# Altium schematic sheet Acondicionamiento_Presion.SchDoc: Modulo de Acondicionamiento de Presion
size A4; Date: 09/2013; Author: Roux, Federico G.; CompanyName: UF; Engineer: Roux, Federico G. (rouxfederico@gmail.com); Organization: UF; Address1: rouxfederico@gmail.com; Revision: 1.0; DocumentName: Acondicionamiento_Presion; ProjectName: Pres24 (Módulos); Rule: PcbType=ProtelPcb
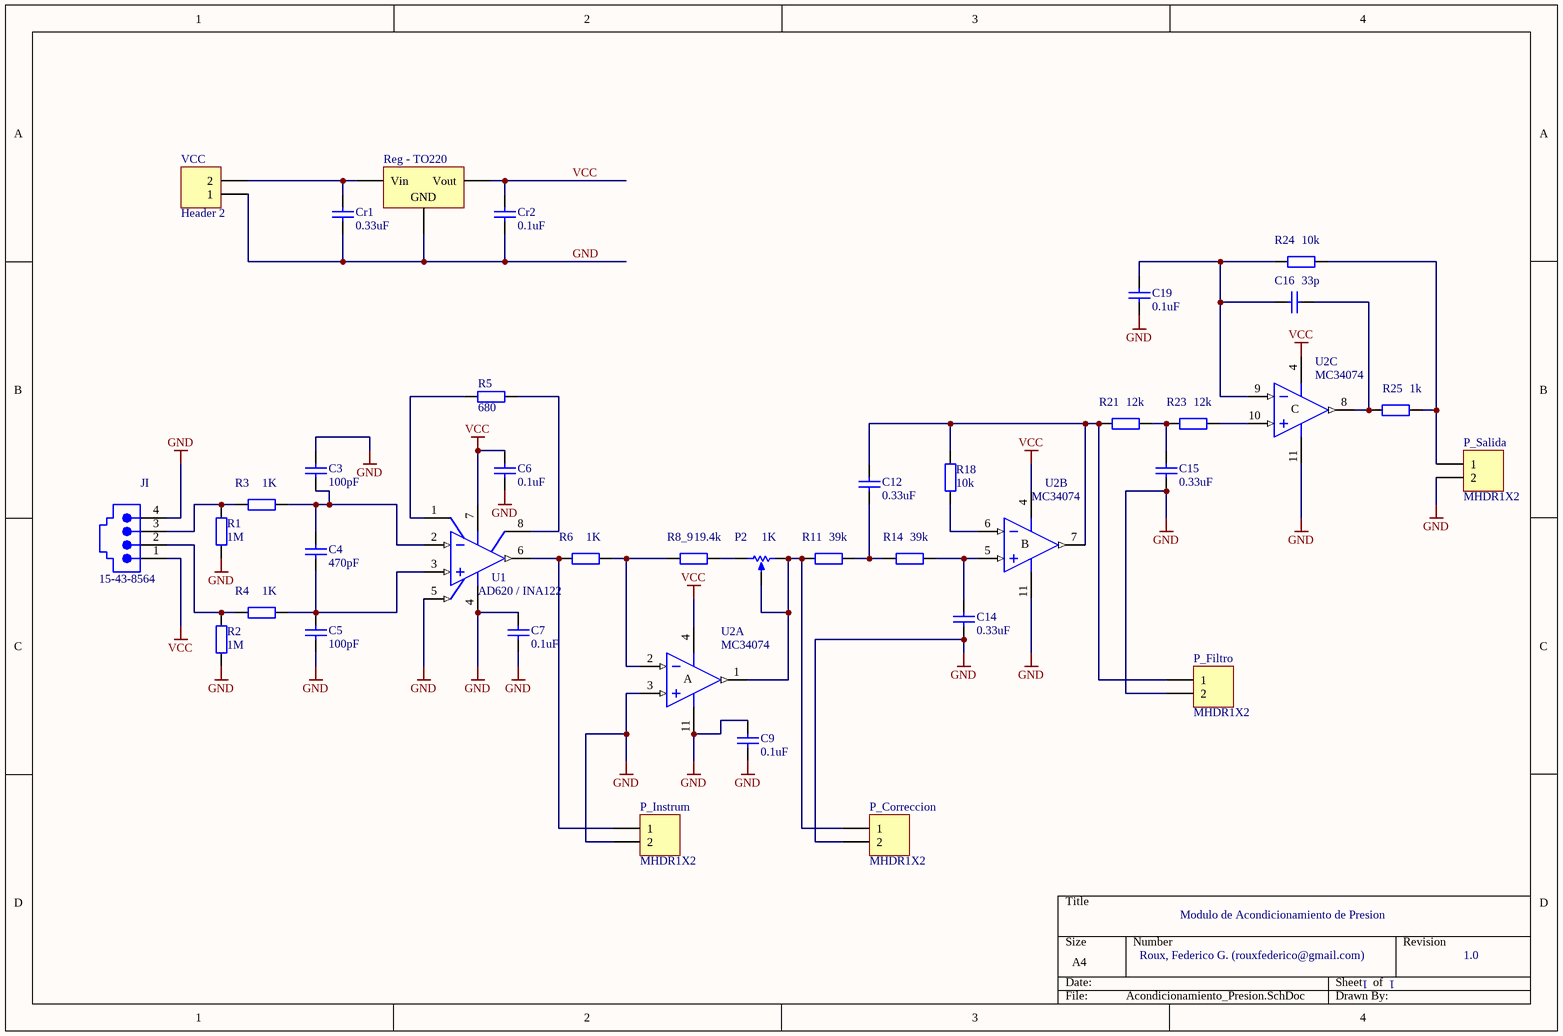
[diagram p0: Acondicionamiento_Presion.SchDoc]

## Parts
C3  value 100pF  [AXIAL-0.3]  (hidden comment: Cap)
C4  value 470pF  [AXIAL-0.3]  (hidden comment: Cap)
C5  value 100pF  [AXIAL-0.3]  (hidden comment: Cap)
C6  value 0.1uF  [AXIAL-0.3]  (hidden comment: Cap)
C7  value 0.1uF  [AXIAL-0.3]  (hidden comment: Cap)
C9  value 0.1uF  [AXIAL-0.3]  (hidden comment: Cap)
C12  value 0.33uF  [AXIAL-0.3]  (hidden comment: Cap)
C14  value 0.33uF  [AXIAL-0.3]  (hidden comment: Cap)
C15  value 0.33uF  [AXIAL-0.3]  (hidden comment: Cap)
C16  value 33p  [AXIAL-0.3]  (hidden comment: Cap)
C19  value 0.1uF  [AXIAL-0.3]  (hidden comment: Cap)
Cr1  value 0.33uF  [AXIAL-0.3]  (hidden comment: Cap)
Cr2  value 0.1uF  [AXIAL-0.3]  (hidden comment: Cap)
JI  15-43-8564  [15-43-8564]
P2  value 1K  [VR5]  (hidden comment: RPot)
P_Correccion  MHDR1X2  [MHDR1X2]
P_Filtro  MHDR1X2  [MHDR1X2]
P_Instrum  MHDR1X2  [MHDR1X2]
P_Salida  MHDR1X2  [MHDR1X2]
R1  value 1M  [AXIAL-0.3]  (hidden comment: Res2)
R2  value 1M  [AXIAL-0.3]  (hidden comment: Res2)
R3  value 1K  [AXIAL-0.3]  (hidden comment: Res2)
R4  value 1K  [AXIAL-0.3]  (hidden comment: Res2)
R5  value 680  [AXIAL-0.3]  (hidden comment: Res2)
R6  value 1K  [AXIAL-0.3]  (hidden comment: Res2)
R8_9  value 19.4k  [AXIAL-0.3]  (hidden comment: Res2)
R11  value 39k  [AXIAL-0.3]  (hidden comment: Res2)
R14  value 39k  [AXIAL-0.3]  (hidden comment: Res2)
R18  value 10k  [AXIAL-0.3]  (hidden comment: Res2)
R21  value 12k  [AXIAL-0.3]  (hidden comment: Res2)
R23  value 12k  [AXIAL-0.3]  (hidden comment: Res2)
R24  value 10k  [AXIAL-0.3]  (hidden comment: Res2)
R25  value 1k  [AXIAL-0.3]  (hidden comment: Res2)
Reg_-_TO220  Volt Reg  [TO-220-AB]  (value not drawn)
U1  AD620 / INA122  [DIP-8]
U2  MC34074  [DIP-14]  (parts A,B,C of 4)
VCC  Header 2  [HDR1X2]

## Nets
GND: C3.2 C5.1 C6.2 C7.1 C7.2 C9.1 C9.2 C14.2 C15.2 C19.2 Cr1.2 Cr2.2 JI.4 P_Correccion.2 P_Filtro.2 P_Instrum.2 P_Salida.2 R1.1 R2.1 Reg_-_TO220.2(GND) U1.4(V-) U1.5(REF) U2.3(IN+) U2.11(V-) VCC.1
VCC: C6.1 Cr2.1 JI.1 Reg_-_TO220.3(Vout) U1.7(V+) U2.4(V+)
NetC3_1: C3.1 C4.2 R3.2 U1.2(-IN)
NetC4_1: C4.1 C5.2 R4.2 U1.3(+IN)
NetC12_1: C12.1 P_Filtro.1 R18.2 R21.1 U2.7(OUT)
NetC12_2: C12.2 R11.2 R14.1
NetC14_1: C14.1 R14.2 U2.5(IN+)
NetC15_1: C15.1 R21.2 R23.1
NetC16_1: C16.1 C19.1 R24.1 U2.9(IN-)
NetC16_2: C16.2 R25.1 U2.8(OUT)
NetCr1_1: Cr1.1 Reg_-_TO220.1(Vin) VCC.2
NetJI_2: JI.2 R2.2 R4.1
NetJI_3: JI.3 R1.2 R3.1
NetP2_1: P2.1(TOP) R8_9.2
NetP2_2: P2.2(BOT) P2.3(TAP) P_Correccion.1 R11.1 U2.1(OUT)
NetP_Instrum_1: P_Instrum.1 R6.1 U1.6(OUT)
NetP_Salida_1: P_Salida.1 R24.2 R25.2
NetR5_1: R5.1 U1.8(RG)
NetR5_2: R5.2 U1.1(RG)
NetR6_2: R6.2 R8_9.1 U2.2(IN-)
NetR18_1: R18.1 U2.6(IN-)
NetR23_2: R23.2 U2.10(IN+)

## Notes on the sheet
- 1
- (in symbol AD713BQ, part A) A
- (in symbol AD713BQ, part B) B
- (in symbol AD713BQ, part C) C

## Library data of the parts
C3-C7 C9 C12 C14-C16 C19 Cr1 Cr2 = Cap: Capacitor; Published: 8-Jun-2000; LatestRevisionDate: 17-Jul-2002; LatestRevisionNote: Re-released for DXP Platform.; PackageReference: RAD-0.3; Publisher: Altium Limited; PackageDescription: Radial Cap, Thru-Hole; 2 Leads; 0.3 in Pin Spacing
JI = 15-43-8564: Right Angle, Standard Profile, Unshielded PCB Jack; Ports: 1; Positions/Loaded: Port1 - 6/4; PerformanceCategory: 3; PCB_Mounting: Thru-Hole; DrillSize: Nominal, Rounded to nearest 0.05mm; PCB_Layout: Complies with Manufacturer's Recommendation.; Published: 25-Jun-2002; DatasheetDocument: 18-Dec-2001; PackageDocument: 18-Dec-2001; PackageReference: 15-43-8564; Publisher: Altium Limited; ComponentLink1Description: Manufacturer Link; ComponentLink1URL: http://www.molex.com/; ComponentLink2Description: Datasheet; ComponentLink2URL: http://www.molex.com/cmc_upload/common_files/1212003_41687catalogpage.pdf; ComponentLink3Description: Iges Model; ComponentLink3URL: http://www.molex.com/pdm_docs/igs/15-43-8501_igs.zip
P2 = RPot: Potentiometer; Sim Note: Enter the Resistance value and the set point into parameter fields.; Set Position: 0.5; Published: 8-Jun-2000; LatestRevisionDate: 17-Jul-2002; LatestRevisionNote: Re-released for DXP Platform.; PackageReference: VR5; Publisher: Altium Limited; PackageDescription: Variable Resistor, Thru-Hole; 3 Leads
P_Correccion P_Filtro P_Instrum P_Salida = MHDR1X2: Header, 2-Pin; LatestRevisionDate: 17-Jul-2002; LatestRevisionNote: Re-released for DXP Platform.; Publisher: Altium Limited
R1-R6 R8_9 R11 R14 R18 R21 R23-R25 = Res2: Resistor; Published: 8-Jun-2000; LatestRevisionDate: 17-Jul-2002; LatestRevisionNote: Re-released for DXP Platform.; PackageReference: AXIAL-0.4; Publisher: Altium Limited; PackageDescription: Axial Device, Thru-Hole; 2 Leads; 0.4 in Pin Spacing
Reg_-_TO220 = Volt Reg: Voltage Regulator; Published: 24-Mar-1999; LatestRevisionDate: 29-May-2009; LatestRevisionNote: IPC-7351 Footprint Added.; PackageReference: D2PAK; Publisher: Altium Limited; PackageDescription: 3-Pin Transistor Outline Package 2.54 mm Pitch, 15.1 mm Lead Span
U1 = AD620BN: Low-Cost, Low-Power Instrumentation Amplifier; Published: 8-Jun-2000; LatestRevisionDate: 04-Mar-2005; LatestRevisionNote: Stylized 3D Model Added.; DatasheetVersion: REV.D 1998; PackageVersion: revA; PackageReference: N-8; Publisher: Altium Limited; PackageDescription: DIP; 8 Leads; Row Spacing 7.62 mm; Pitch 2.54 mm; ComponentLink1Description: Manufacturer Link; ComponentLink1URL: http://www.analog.com/en/prod/0%2C2877%2CAD620%2C00.html; ComponentLink2Description: Datasheet; ComponentLink2URL: http://www.analog.com/UploadedFiles/Data_Sheets/897653854AD620_g.pdf
U2 = AD713BQ: Quad Precision Low Cost High-Speed BiFET Operational Amplifier; Published: 8-Jun-2000; LatestRevisionDate: 04-Mar-2005; LatestRevisionNote: Stylized 3D Model Added.; DatasheetVersion: REV. B; PackageVersion: revB; PackageReference: Q-14; Publisher: Altium Limited; PackageDescription: DIP; 14 Leads; Row Spacing 7.62 mm; Pitch 2.54 mm; ComponentLink1Description: Manufacturer Link; ComponentLink1URL: http://www.analog.com/en/prod/0,,759_786_AD713%2C00.html; ComponentLink2Description: Datasheet; ComponentLink2URL: http://www.analog.com/UploadedFiles/Data_Sheets/70859332AD713_c.pdf
VCC = Header 2: Header, 2-Pin; LatestRevisionDate: 17-Jul-2002; LatestRevisionNote: Re-released for DXP Platform.; Publisher: Altium Limited